# EAGLE schematic top (EAGLE 5.07)
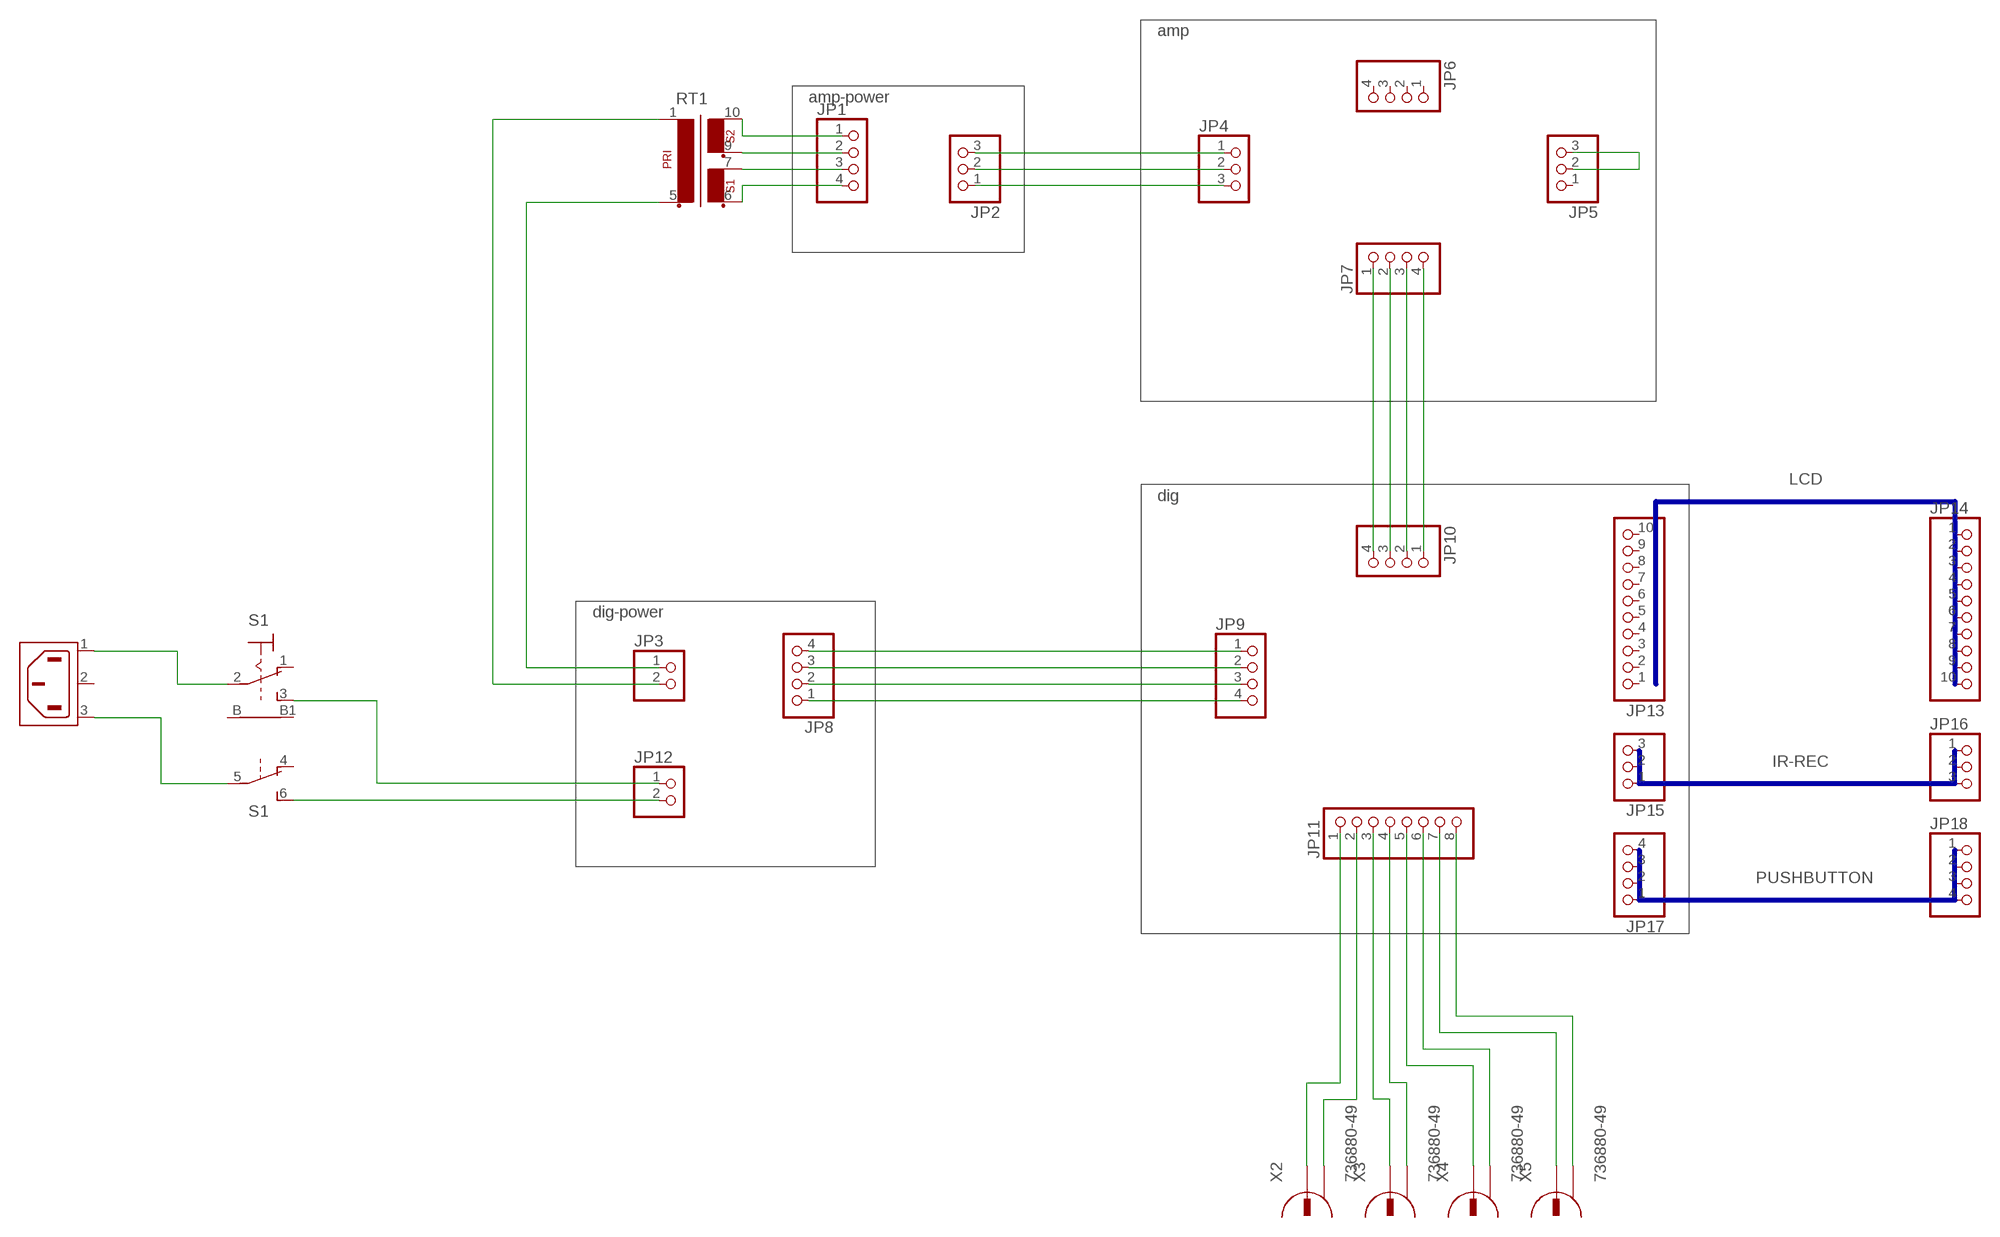
[diagram p0: schematic, sheet 1]

## Parts
JP1  PINHD-1X4  [1X04]
JP2  PINHD-1X3  [1X03]
JP3  PINHD-1X2  [1X02]
JP4  PINHD-1X3  [1X03]
JP5  PINHD-1X3  [1X03]
JP6  PINHD-1X4  [1X04]
JP7  PINHD-1X4  [1X04]
JP8  PINHD-1X4  [1X04]
JP9  PINHD-1X4  [1X04]
JP10  PINHD-1X4  [1X04]
JP11  PINHD-1X8  [1X08]
JP12  PINHD-1X2  [1X02]
JP13  PINHD-1X10  [1X10]
JP14  PINHD-1X10  [1X10]
JP15  PINHD-1X3  [1X03]
JP16  PINHD-1X3  [1X03]
JP17  PINHD-1X4  [1X04]
JP18  PINHD-1X4  [1X04]
RT1  EI30-2  [EI30-2]
S1  316-923  [316-923]
X1  6ESRM-P  [6ESRM-P]
X2  736880-49  [736880-49]
X3  736880-49  [736880-49]
X4  736880-49  [736880-49]
X5  736880-49  [736880-49]

## Nets
N$1: S1.2(2:P) X1.1(AC1)
N$2: S1.5(B:P) X1.3(AC2)
N$3: JP3.1 RT1.5
N$4: JP3.2 RT1.1
N$5: JP2.3 JP4.1
N$6: JP2.2 JP4.2
N$7: JP2.1 JP4.3
N$8: JP8.4 JP9.1
N$9: JP8.3 JP9.2
N$10: JP8.2 JP9.3
N$11: JP8.1 JP9.4
N$12: JP12.2 S1.6(B:S)
N$13: JP12.1 S1.3(2:S)
N$14: JP7.1 JP10.4
N$15: JP7.2 JP10.3
N$16: JP7.3 JP10.2
N$17: JP7.4 JP10.1
N$18: JP5.2 JP5.3
N$19: JP11.1 X2.1
N$20: JP11.2 X2.2
N$21: JP11.3 X3.1
N$22: JP11.4 X3.2
N$23: JP11.5 X4.1
N$24: JP11.6 X4.2
N$25: JP11.7 X5.1
N$26: JP11.8 X5.2
N$27: JP1.1 RT1.10
N$28: JP1.2 RT1.9
N$29: JP1.3 RT1.7
N$30: JP1.4 RT1.6
Unconnected: JP5.1 JP6.1 JP6.2 JP6.3 JP6.4 JP13.1 JP13.2 JP13.3 JP13.4 JP13.5 JP13.6 JP13.7 JP13.8 JP13.9 JP13.10 JP14.1 JP14.2 JP14.3 JP14.4 JP14.5 JP14.6 JP14.7 JP14.8 JP14.9 JP14.10 JP15.1 JP15.2 JP15.3 JP16.1 JP16.2 JP16.3 JP17.1 JP17.2 JP17.3 JP17.4 JP18.1 JP18.2 JP18.3 JP18.4 S1.1(2:O) S1.4(B:O) S1.B1(2:B1) S1.B(2:B) X1.2(SH) X2.2@2 X3.2@2 X4.2@2 X5.2@2

## Buses
LCD
IR-REC
PUSHBUTTON

## Notes on the sheet
- amp
- amp-power
- dig
- dig-power

## Library data of the parts
JP1 JP6-JP10 JP17 JP18 = pinhead:PINHD-1X4: PIN HEADER
JP2 JP4 JP5 JP15 JP16 = pinhead:PINHD-1X3: PIN HEADER
JP3 JP12 = pinhead:PINHD-1X2: PIN HEADER
JP11 = pinhead:PINHD-1X8: PIN HEADER
JP13 JP14 = pinhead:PINHD-1X10: PIN HEADER
RT1 = trafo:EI30-2: TRANSFORMER 1 primary winding, 2 secondary windings ERA
S1 = switch:316-923: TOGGLE SWITCH Mors, distributor RS Components
X1 = con-tycoelectronics:6ESRM-P: AC Connector 120/250 VAC Source: http://catalog.tycoelectronics.com .. ENG_DS_1654001_1099_SR_0406.pdf
X2-X5 = con-conrad:736880-49: Cinch Connector ( RCA Jack )